# Altium schematic sheet Sheet_NEW.SchDoc
size 840 x 594 mm; Address1: Address1; Address2: Address2; Address3: Address3; Address4: Address4; DocumentNumber: АБВГ.123456.001 Э3; SheetNumber: 1; Scale: 1:1; DocumentType: Схема электрическая принципиальная; FirstReferrence: АБВГ.123456.001
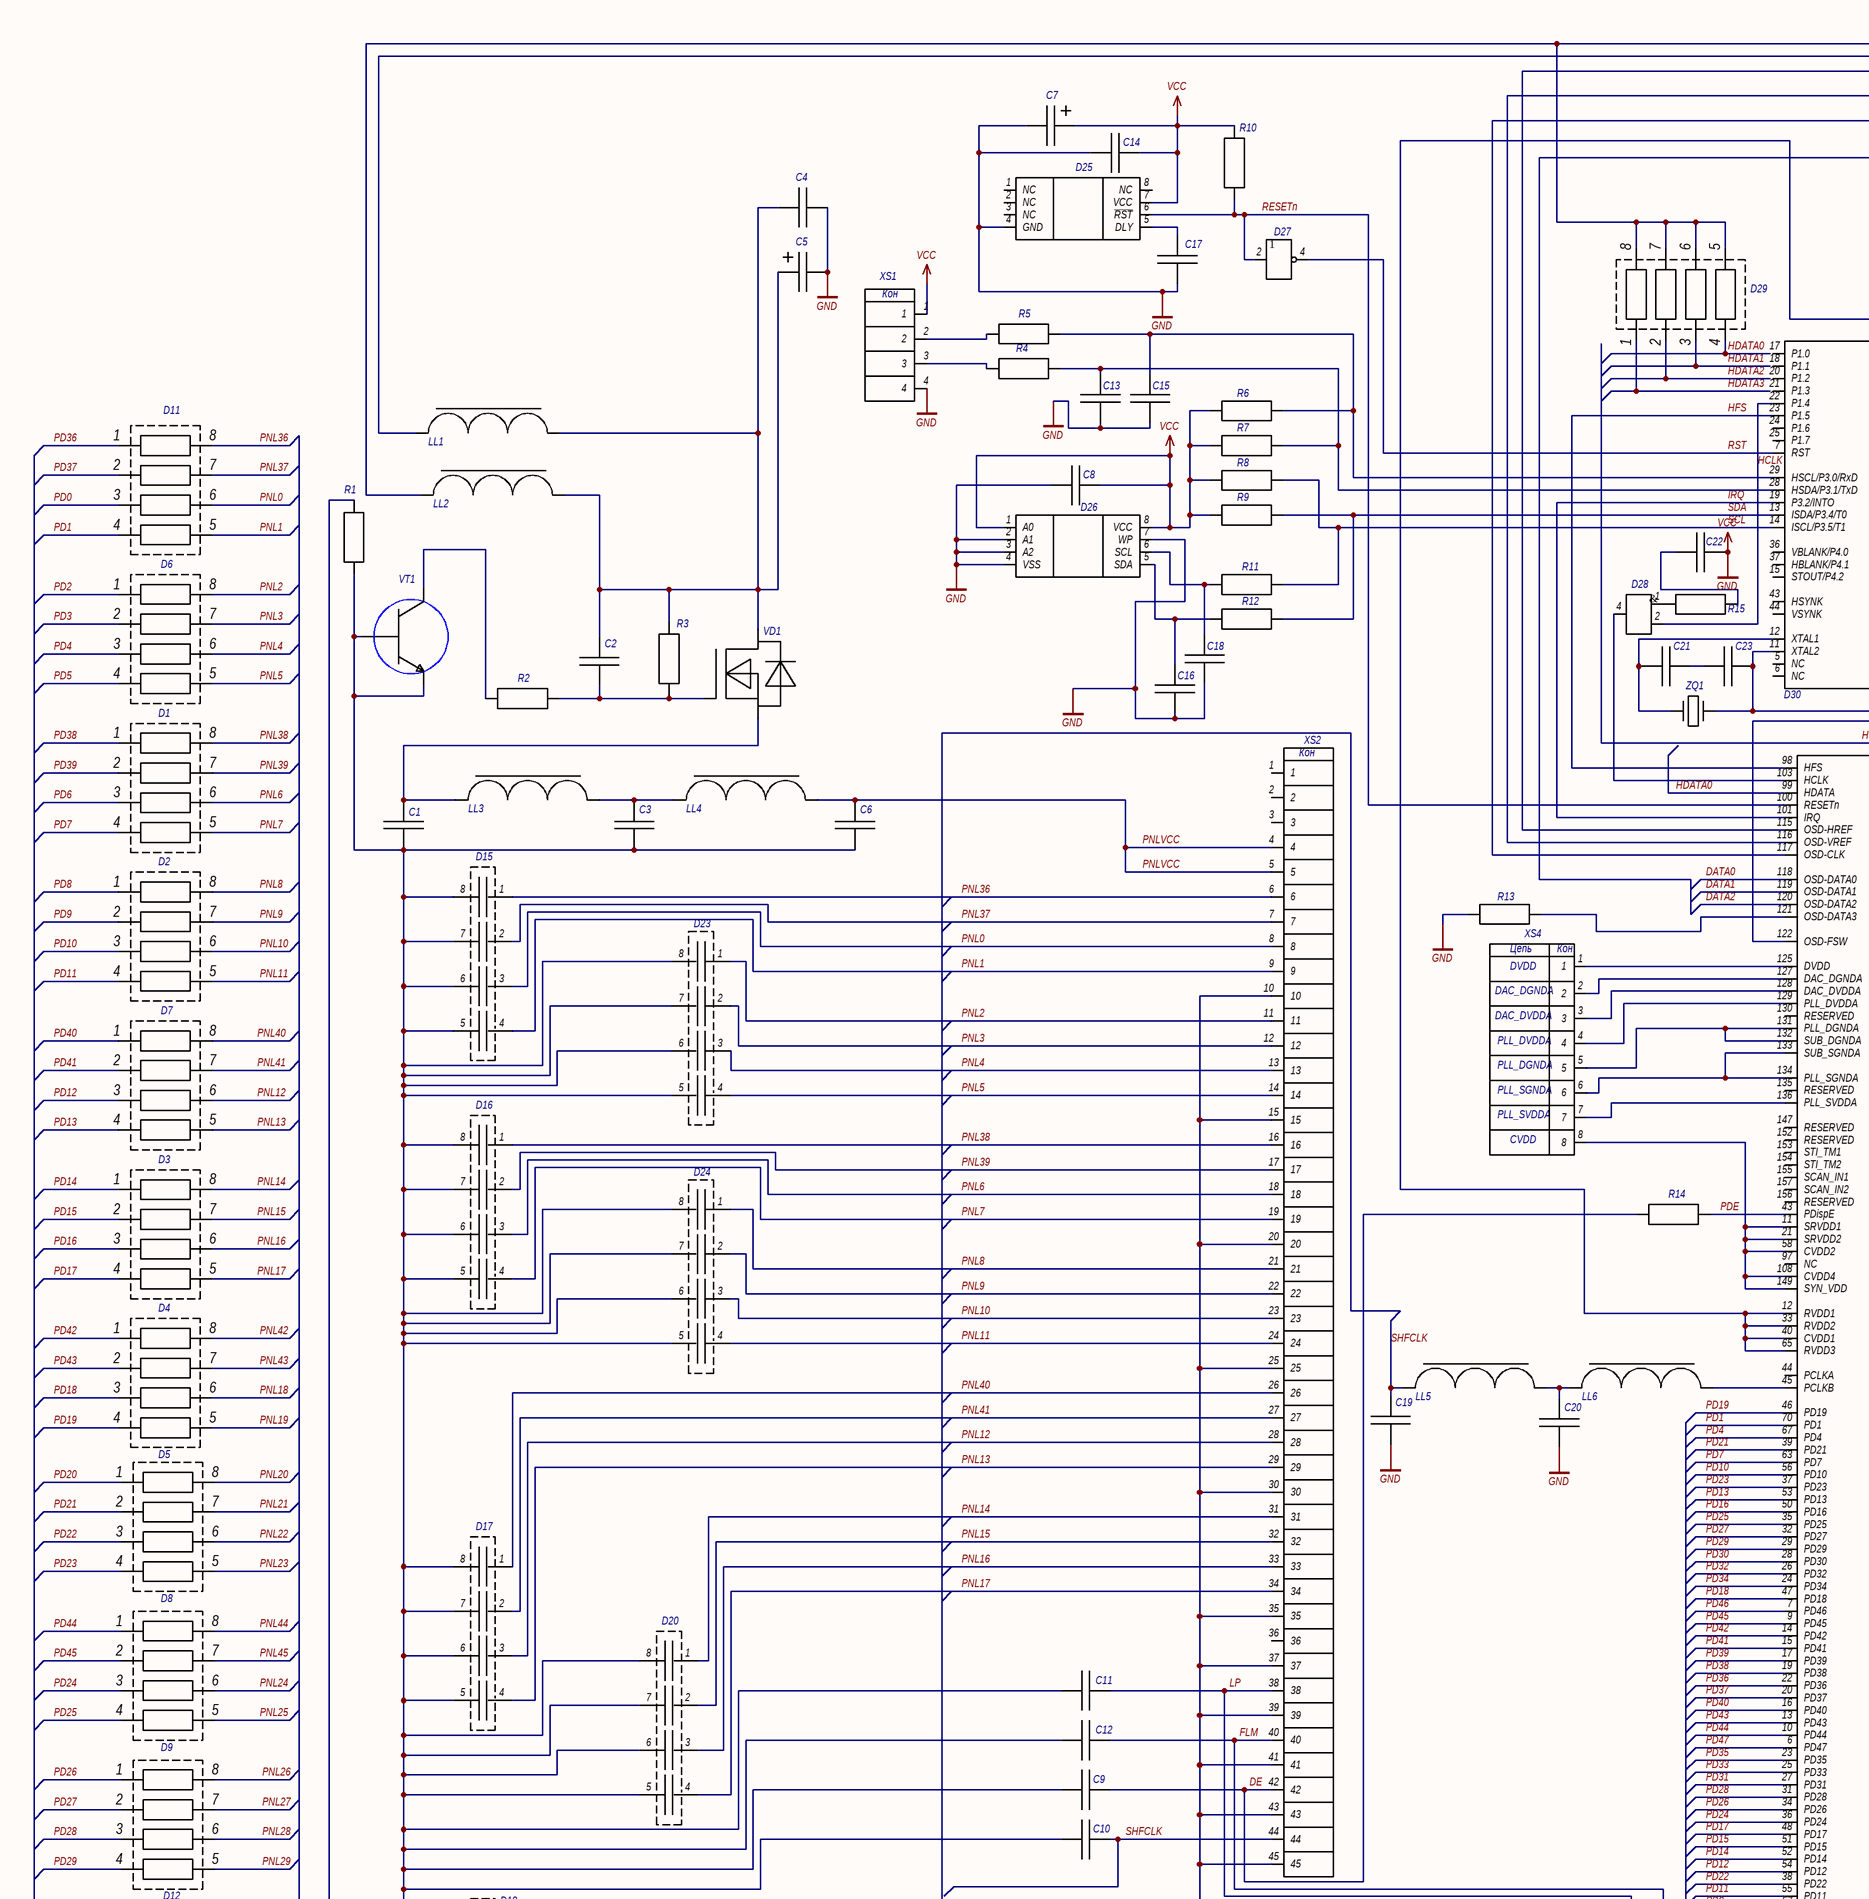
[diagram p0: Sheet_NEW.SchDoc, top left]
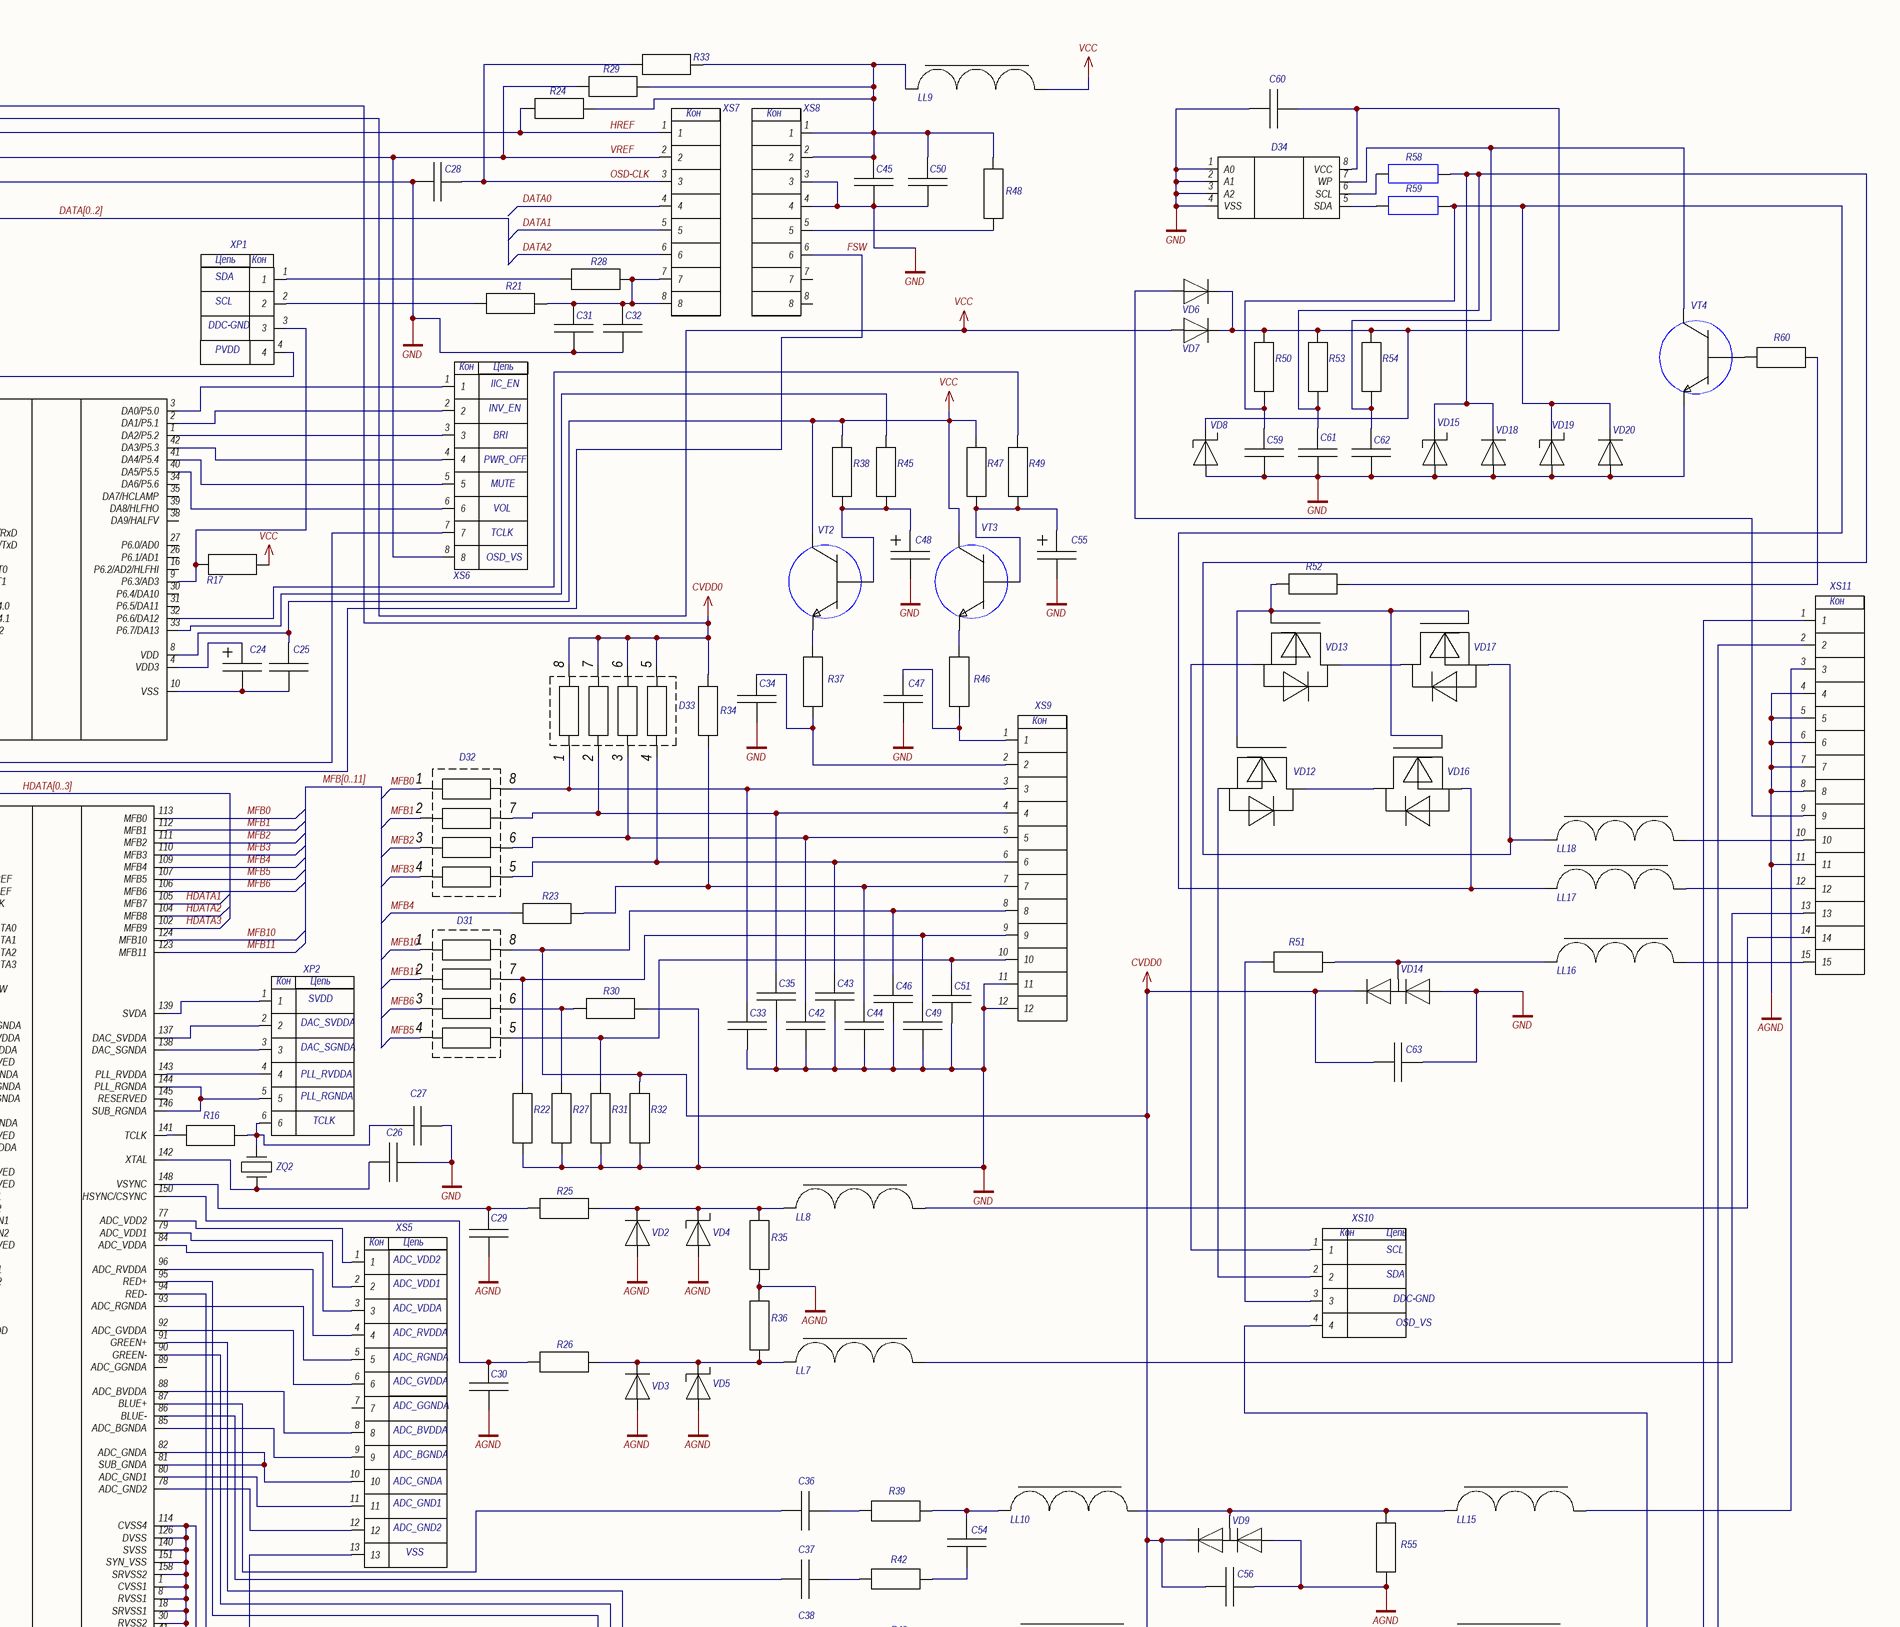
[diagram p1: Sheet_NEW.SchDoc, top right]
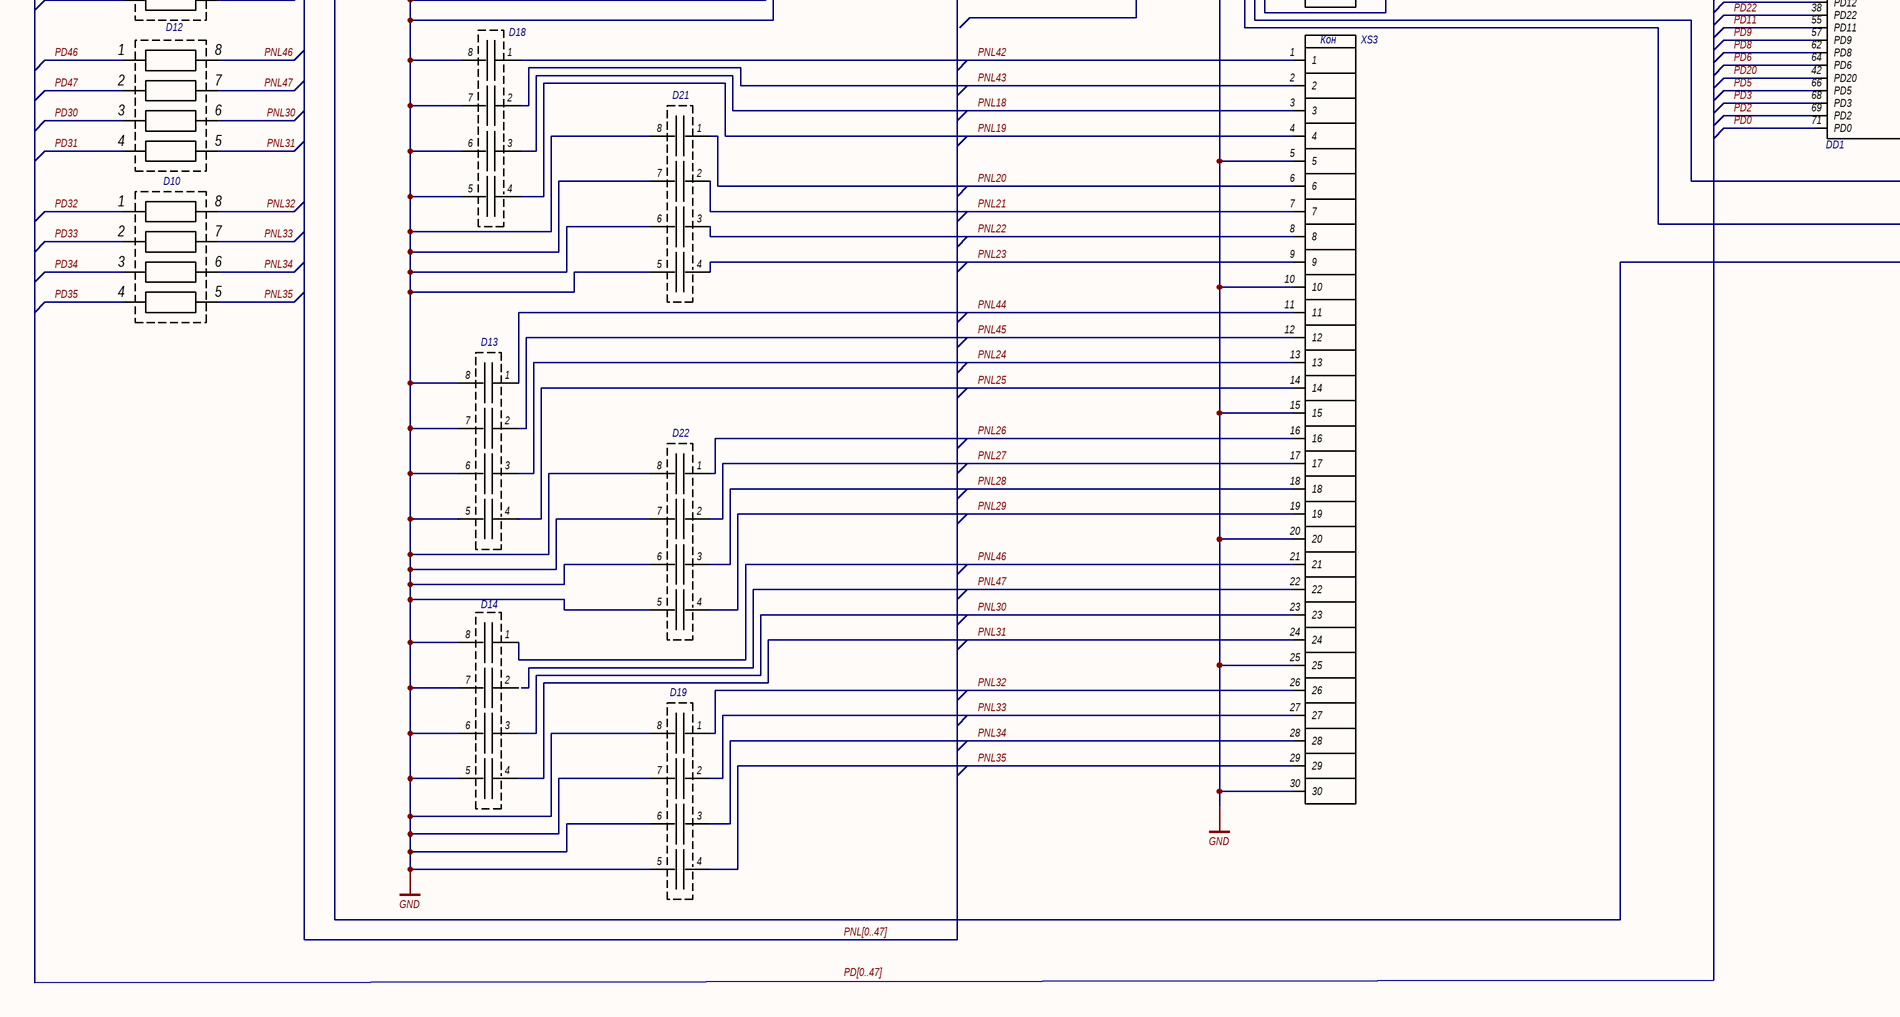
[diagram p2: Sheet_NEW.SchDoc, bottom left]
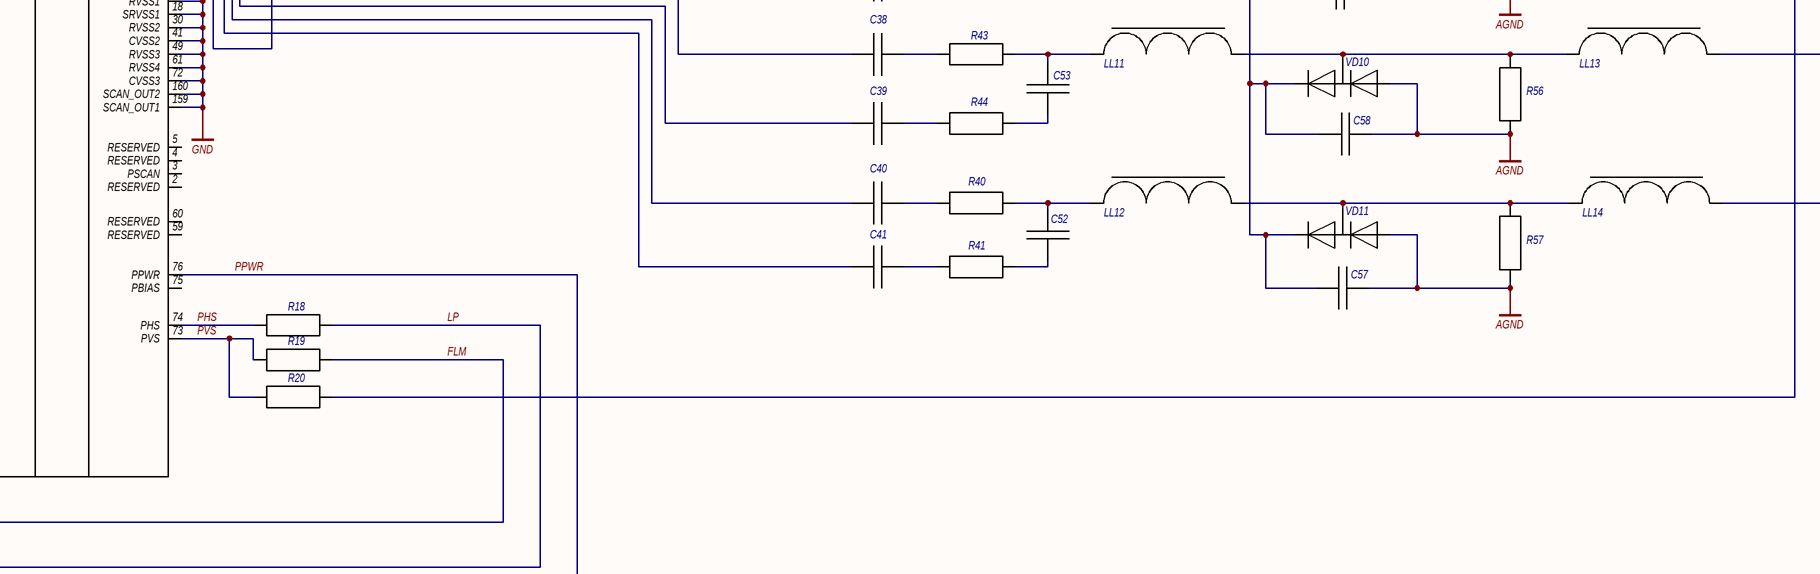
[diagram p3: Sheet_NEW.SchDoc, bottom right]

## Parts
C1  Capacitor  [cap(0603)]  (value not drawn)
C2  Capacitor  [cap(0603)]  (value not drawn)
C3  Capacitor  [cap(0603)]  (value not drawn)
C4  Capacitor  [cap(0603)]  (value not drawn)
C5  Capacitor Duga  [Capacitor 0805]  (value not drawn)
C6  Capacitor  [cap(0603)]  (value not drawn)
C7  Capacitor Duga  [Capacitor 0805]  (value not drawn)
C8  Capacitor  [cap(0603)]  (value not drawn)
C9  Capacitor  [cap(0603)]  (value not drawn)
C10  Capacitor  [cap(0603)]  (value not drawn)
C11  Capacitor  [cap(0603)]  (value not drawn)
C12  Capacitor  [cap(0603)]  (value not drawn)
C13  Capacitor  [cap(0603)]  (value not drawn)
C14  Capacitor  [cap(0603)]  (value not drawn)
C15  Capacitor  [cap(0603)]  (value not drawn)
C16  Capacitor  [cap(0603)]  (value not drawn)
C17  Capacitor  [cap(0603)]  (value not drawn)
C18  Capacitor  [cap(0603)]  (value not drawn)
C19  Capacitor  [cap(0603)]  (value not drawn)
C20  Capacitor  [cap(0603)]  (value not drawn)
C21  Capacitor  [cap(0603)]  (value not drawn)
C22  Capacitor  [cap(0603)]  (value not drawn)
C23  Capacitor  [cap(0603)]  (value not drawn)
C24  Capacitor Duga  [Capacitor 0805]  (value not drawn)
C25  Capacitor  [cap(0603)]  (value not drawn)
C26  Capacitor  [Capacitor 0805]  (value not drawn)
C27  Capacitor  [Capacitor 0805]  (value not drawn)
C28  Capacitor  [cap(0603)]  (value not drawn)
C29  Capacitor  [Capacitor 0805]  (value not drawn)
C30  Capacitor  [Capacitor 0805]  (value not drawn)
C31  Capacitor  [cap(0603)]  (value not drawn)
C32  Capacitor  [cap(0603)]  (value not drawn)
C33  Capacitor  [cap(0603)]  (value not drawn)
C34  Capacitor  [cap(0603)]  (value not drawn)
C35  Capacitor  [cap(0603)]  (value not drawn)
C36  Capacitor  [cap(0603)]  (value not drawn)
C37  Capacitor  [cap(0603)]  (value not drawn)
C38  Capacitor  [cap(0603)]  (value not drawn)
C39  Capacitor  [cap(0603)]  (value not drawn)
C40  Capacitor  [cap(0603)]  (value not drawn)
C41  Capacitor  [cap(0603)]  (value not drawn)
C42  Capacitor  [cap(0603)]  (value not drawn)
C43  Capacitor  [cap(0603)]  (value not drawn)
C44  Capacitor  [cap(0603)]  (value not drawn)
C45  Capacitor  [cap(0603)]  (value not drawn)
C46  Capacitor  [cap(0603)]  (value not drawn)
C47  Capacitor  [cap(0603)]  (value not drawn)
C48  Capacitor Duga  [Capacitor 0805]  (value not drawn)
C49  Capacitor  [cap(0603)]  (value not drawn)
C50  Capacitor  [cap(0603)]  (value not drawn)
C51  Capacitor  [cap(0603)]  (value not drawn)
C52  Capacitor  [cap(0603)]  (value not drawn)
C53  Capacitor  [cap(0603)]  (value not drawn)
C54  Capacitor  [cap(0603)]  (value not drawn)
C55  Capacitor Duga  [Capacitor 0805]  (value not drawn)
C56  Capacitor  [cap(0603)]  (value not drawn)
C57  Capacitor  [cap(0603)]  (value not drawn)
C58  Capacitor  [cap(0603)]  (value not drawn)
C59  Capacitor  [cap(0603)]  (value not drawn)
C60  Capacitor  [cap(0603)]  (value not drawn)
C61  Capacitor  [cap(0603)]  (value not drawn)
C62  Capacitor  [cap(0603)]  (value not drawn)
C63  Capacitor  [cap(0603)]  (value not drawn)
D1  RN  [RN]  (value not drawn)
D2  RN  [RN]  (value not drawn)
D3  RN  [RN]  (value not drawn)
D4  RN  [RN]  (value not drawn)
D5  RN  [RN]  (value not drawn)
D6  RN  [RN]  (value not drawn)
D7  RN  [RN]  (value not drawn)
D8  RN  [RN]  (value not drawn)
D9  RN  [RN]  (value not drawn)
D10  RN  [RN]  (value not drawn)
D11  RN  [RN]  (value not drawn)
D12  RN  [RN]  (value not drawn)
D13  33pFX4  [33pFX4]  (value not drawn)
D14  33pFX4  [33pFX4]  (value not drawn)
D15  33pFX4  [33pFX4]  (value not drawn)
D16  33pFX4  [33pFX4]  (value not drawn)
D17  33pFX4  [33pFX4]  (value not drawn)
D18  33pFX4  [33pFX4]  (value not drawn)
D19  33pFX4  [33pFX4]  (value not drawn)
D20  33pFX4  [33pFX4]  (value not drawn)
D21  33pFX4  [33pFX4]  (value not drawn)
D22  33pFX4  [33pFX4]  (value not drawn)
D23  33pFX4  [33pFX4]  (value not drawn)
D24  33pFX4  [33pFX4]  (value not drawn)
D25  M51953A  [M51953A]  (value not drawn)
D26  24LC32  [24LC32]  (value not drawn)
D27  Inverter  [Inverter]  (value not drawn)
D28  Сonjuncture  [Conjuncture]  (value not drawn)
D29  RN  [RN]  (value not drawn)
D30  MTV312M64  [MTV312M64]  (value not drawn)
D31  RN  [RN]  (value not drawn)
D32  RN  [RN]  (value not drawn)
D33  RN  [RN]  (value not drawn)
D34  24LC32  [24LC32]  (value not drawn)
DD1  gmZAN1_1  [GMZAN1]  (value not drawn)
LL1  dros  [dros]  (value not drawn)
LL2  dros  [dros]  (value not drawn)
LL3  dros  [dros]  (value not drawn)
LL4  dros  [dros]  (value not drawn)
LL5  dros  [dros]  (value not drawn)
LL6  dros  [dros]  (value not drawn)
LL7  dros  [dros]  (value not drawn)
LL8  dros  [dros]  (value not drawn)
LL9  dros  [dros]  (value not drawn)
LL10  dros  [dros]  (value not drawn)
LL11  dros  [dros]  (value not drawn)
LL12  dros  [dros]  (value not drawn)
LL13  dros  [dros]  (value not drawn)
LL14  dros  [dros]  (value not drawn)
LL15  dros  [dros]  (value not drawn)
LL16  dros  [dros]  (value not drawn)
LL17  dros  [dros]  (value not drawn)
LL18  dros  [dros]  (value not drawn)
R1  Resistor  [Resistor 1206]  (value not drawn)
R2  Resistor  [Resistor 1206]  (value not drawn)
R3  Resistor  [Resistor 1206]  (value not drawn)
R4  Resistor  [Resistor 1206]  (value not drawn)
R5  Resistor  [Resistor 1206]  (value not drawn)
R6  Resistor  [Resistor 1206]  (value not drawn)
R7  Resistor  [Resistor 1206]  (value not drawn)
R8  Resistor  [Resistor 1206]  (value not drawn)
R9  Resistor  [Resistor 1206]  (value not drawn)
R10  Resistor  [Resistor 1206]  (value not drawn)
R11  Resistor  [Resistor 1206]  (value not drawn)
R12  Resistor  [Resistor 1206]  (value not drawn)
R13  Resistor  [Resistor 1206]  (value not drawn)
R14  Resistor  [Resistor 1206]  (value not drawn)
R15  Resistor  [Resistor 1206]  (value not drawn)
R16  Resistor  [Resistor 1206]  (value not drawn)
R17  Resistor  [Resistor 1206]  (value not drawn)
R18  Resistor  [Resistor 1206]  (value not drawn)
R19  Resistor  [Resistor 1206]  (value not drawn)
R20  Resistor  [Resistor 1206]  (value not drawn)
R21  Resistor  [Resistor 1206]  (value not drawn)
R22  Resistor  [Resistor 1206]  (value not drawn)
R23  Resistor  [Resistor 1206]  (value not drawn)
R24  Resistor  [Resistor 1206]  (value not drawn)
R25  Resistor  [Resistor 1206]  (value not drawn)
R26  Resistor  [Resistor 1206]  (value not drawn)
R27  Resistor  [Resistor 1206]  (value not drawn)
R28  Resistor  [Resistor 1206]  (value not drawn)
R29  Resistor  [Resistor 1206]  (value not drawn)
R30  Resistor  [Resistor 1206]  (value not drawn)
R31  Resistor  [Resistor 1206]  (value not drawn)
R32  Resistor  [Resistor 1206]  (value not drawn)
R33  Resistor  [Resistor 1206]  (value not drawn)
R34  Resistor  [Resistor 1206]  (value not drawn)
R35  Resistor  [Resistor 1206]  (value not drawn)
R36  Resistor  [Resistor 1206]  (value not drawn)
R37  Resistor  [Resistor 1206]  (value not drawn)
R38  Resistor  [Resistor 1206]  (value not drawn)
R39  Resistor  [Resistor 1206]  (value not drawn)
R40  Resistor  [Resistor 1206]  (value not drawn)
R41  Resistor  [Resistor 1206]  (value not drawn)
R42  Resistor  [Resistor 1206]  (value not drawn)
R43  Resistor  [Resistor 1206]  (value not drawn)
R44  Resistor  [Resistor 1206]  (value not drawn)
R45  Resistor  [Resistor 1206]  (value not drawn)
R46  Resistor  [Resistor 1206]  (value not drawn)
R47  Resistor  [Resistor 1206]  (value not drawn)
R48  Resistor  [Resistor 1206]  (value not drawn)
R49  Resistor  [Resistor 1206]  (value not drawn)
R50  Resistor  [Resistor 1206]  (value not drawn)
R51  Resistor  [Resistor 1206]  (value not drawn)
R52  Resistor  [Resistor 1206]  (value not drawn)
R53  Resistor  [Resistor 1206]  (value not drawn)
R54  Resistor  [Resistor 1206]  (value not drawn)
R55  Resistor  [Resistor 1206]  (value not drawn)
R56  Resistor  [Resistor 1206]  (value not drawn)
R57  Resistor  [Resistor 1206]  (value not drawn)
R58  Res  [res(0603)]  (value not drawn)
R59  Res  [res(0603)]  (value not drawn)
R60  Resistor  [Resistor 1206]  (value not drawn)
VD1  2SK3018  [DAT17]  (value not drawn)
VD2  Diode  [DIODE]  (value not drawn)
VD3  Diode  [DIODE]  (value not drawn)
VD4  Diode(shotki)  [Diode(shotki)]  (value not drawn)
VD5  Diode(shotki)  [Diode(shotki)]  (value not drawn)
VD6  Diode  [DIODE]  (value not drawn)
VD7  Diode  [DIODE]  (value not drawn)
VD8  Diode(shotki)  [Diode(shotki)]  (value not drawn)
VD9  DAN17  [DAT17]  (value not drawn)
VD10  DAN17  [DAT17]  (value not drawn)
VD11  DAN17  [DAT17]  (value not drawn)
VD12  2SK3018  [DAT17]  (value not drawn)
VD13  2SK3018  [DAT17]  (value not drawn)
VD14  DAN17  [DAT17]  (value not drawn)
VD15  Diode(shotki)  [Diode(shotki)]  (value not drawn)
VD16  2SK3018  [DAT17]  (value not drawn)
VD17  2SK3018  [DAT17]  (value not drawn)
VD18  Diode  [DIODE]  (value not drawn)
VD19  Diode(shotki)  [Diode(shotki)]  (value not drawn)
VD20  Diode  [DIODE]  (value not drawn)
VT1  Transistor 2_1  [Transistor 1]  (value not drawn)
VT2  Transistor 2_1  [Transistor 1]  (value not drawn)
VT3  Transistor 2_1  [Transistor 1]  (value not drawn)
VT4  Transistor 2_1  [Transistor 1]  (value not drawn)
XP1  All pins_1  [Header 4]  (value not drawn)
XP2  XP-2-I306B  [All pins]  (value not drawn)
XS1  Header 4  [Header 4]  (value not drawn)
XS2  Header 45  [Header 45]  (value not drawn)
XS3  Header 30  [Header 30]  (value not drawn)
XS4  XS-2-I306B  [Header 8]  (value not drawn)
XS5  XS-2-I306C  [header 13]  (value not drawn)
XS6  All pins_2  [All pins]  (value not drawn)
XS7  Header 8  [All pins]  (value not drawn)
XS8  Header 8_1  [All pins]  (value not drawn)
XS9  Header 12  [All pins]  (value not drawn)
XS10  Header 4  [Header 4]  (value not drawn)
XS11  Header 15  [All pins]  (value not drawn)
ZQ1  Quartz  [HC-49/U]  (value not drawn)
ZQ2  Quartz  [HC-49/U]  (value not drawn)

## Nets
AGND: C29.1 C30.1 C56.1 C57.1 C58.1 R35.2 R36.1 R55.1 R56.1 R57.1 VD2.1 VD3.1 VD4.1 VD5.1 VD9.2 VD10.2 VD11.2 XS11.4 XS11.5 XS11.6 XS11.7 XS11.8 XS11.11
CVDD0: C46.2 C56.2 C57.2 C58.2 C63.2 D29.5 D29.6 D29.7 D29.8 D31.8 D33.5 D33.6 D33.7 D33.8 LL2.1 R32.2 R34.2 VD9.1 VD10.1 VD11.1 VD14.1 XS9.8
GND: C1.1 C3.1 C4.1 C5.1 C6.1 C7.1 C7.2 C8.1 C8.2 C9.2 C10.2 C11.2 C12.2 C13.1 C14.1 C14.2 C15.1 C16.1 C17.1 C18.1 C19.1 C20.1 C22.1 C25.2 C26.1 C27.1 C28.1 C31.1 C32.1 C33.1 C34.1 C35.1 C42.1 C43.1 C44.1 C45.1 C46.1 C47.1 C48.1 C49.1 C50.1 C51.1 C55.1 C59.1 C60.2 C61.1 C62.1 C63.1 D13.5 D13.6 D13.7 D13.8 D14.5 D14.6 D14.7 D14.8 D15.5 D15.6 D15.7 D15.8 D16.5 D16.6 D16.7 D16.8 D17.5 D17.6 D17.7 D17.8 D18.5 D18.6 D18.7 D18.8 D19.5 D19.6 D19.7 D19.8 D20.5 D20.6 D20.7 D20.8 D21.5 D21.6 D21.7 D21.8 D22.5 D22.6 D22.7 D22.8 D23.5 D23.6 D23.7 D23.8 D24.5 D24.6 D24.7 D24.8 D25.4(GND) D25.7(VCC) D26.1(A0) D26.2(A1) D26.3(A2) D26.4(VSS) D26.7(WP) D26.8(VCC) D27.3(GND) D27.5(VCC) D28.3(GND) D28.5(VCC) D30.8(VDD) D34.1(A0) D34.2(A1) D34.3(A2) D34.4(VSS) DD1.1(CVSS1) DD1.8(RVSS1) DD1.18(SRVSS1) DD1.30(RVSS2) DD1.41(CVSS2) DD1.49(RVSS3) DD1.61(RVSS4) DD1.72(CVSS3) DD1.114(CVSS4) DD1.117(OSD-CLK) DD1.126(DVSS) DD1.140(SVSS) DD1.151(SYN_VSS) DD1.158(SRVSS2) DD1.159(SCAN_OUT1) DD1.160(SCAN_OUT2) LL1.1 LL9.2 R1.1 R6.1 R7.1 R8.1 R9.1 R10.2 R13.1 R17.1 R22.1 R27.1 R30.2 R31.1 R32.1 R38.1 R47.1 VD7.1 VD8.1 VD14.2 VD15.1 VD18.1 VD19.1 VD20.1 VT1.2(EMITTER) VT1.3(BAZA) VT2.1(KOLLECTOR) VT3.1(KOLLECTOR) VT4.2(EMITTER) XS1.1 XS1.4 XS2.10 XS2.15 XS2.20 XS2.25 XS2.30 XS2.35 XS2.37 XS2.39 XS2.41 XS2.43 XS2.45 XS3.5 XS3.10 XS3.15 XS3.20 XS3.25 XS3.30 XS5.13 XS8.3 XS8.4 XS9.11 XS9.12  [also labelled VCC]
DATA0: DD1.118(OSD-DATA0) XS7.4
DATA1: DD1.119(OSD-DATA1) XS7.5
DATA2: DD1.120(OSD-DATA2) XS7.6
DE: C9.1 R14.1 XS2.42
FLM: C12.1 R19.2 XS2.40
FSW: DD1.122(OSD-FSW) XS8.6
HCLK: D28.2 D30.22(P1.4)
HDATA0: D29.4 DD1.99(HDATA)
HDATA1: D29.3 DD1.105(MFB7)
HDATA2: D29.2 DD1.104(MFB8)
HDATA3: D29.1 DD1.102(MFB9)
HFS: D30.23(P1.5) DD1.98(HFS)
HREF: DD1.115(OSD-HREF) R24.1 XS7.1
IRQ: D30.19(P3.2/INTO) DD1.101(IRQ)
LP: C11.1 R18.2 XS2.38
MFB0: D32.1 DD1.113(MFB0)
MFB1: D32.2 DD1.112(MFB1)
MFB2: D32.3 DD1.111(MFB2)
MFB3: D32.4 DD1.110(MFB3)
MFB4: DD1.109(MFB4) R23.1
MFB5: D31.4 DD1.107(MFB5)
MFB6: D31.3 DD1.106(MFB6)
MFB10: D31.1 DD1.124(MFB10)
MFB11: D31.2 DD1.123(MFB11)
OSD-CLK: C28.2 R33.1 XS7.3
PD0: D11.3 DD1.71(PD0)
PD1: D11.4 DD1.70(PD1)
PD2: D6.1 DD1.69(PD2)
PD3: D6.2 DD1.68(PD3)
PD4: D6.3 DD1.67(PD4)
PD5: D6.4 DD1.66(PD5)
PD6: D1.3 DD1.64(PD6)
PD7: D1.4 DD1.63(PD7)
PD8: D2.1 DD1.62(PD8)
PD9: D2.2 DD1.57(PD9)
PD10: D2.3 DD1.56(PD10)
PD11: D2.4 DD1.55(PD11)
PD12: D7.3 DD1.54(PD12)
PD13: D7.4 DD1.53(PD13)
PD14: D3.1 DD1.52(PD14)
PD15: D3.2 DD1.51(PD15)
PD16: D3.3 DD1.50(PD16)
PD17: D3.4 DD1.48(PD17)
PD18: D4.3 DD1.47(PD18)
PD19: D4.4 DD1.46(PD19)
PD20: D5.1 DD1.42(PD20)
PD21: D5.2 DD1.39(PD21)
PD22: D5.3 DD1.38(PD22)
PD23: D5.4 DD1.37(PD23)
PD24: D8.3 DD1.36(PD24)
PD25: D8.4 DD1.35(PD25)
PD26: D9.1 DD1.34(PD26)
PD27: D9.2 DD1.32(PD27)
PD28: D9.3 DD1.31(PD28)
PD29: D9.4 DD1.29(PD29)
PD30: D12.3 DD1.28(PD30)
PD31: D12.4 DD1.27(PD31)
PD32: D10.1 DD1.26(PD32)
PD33: D10.2 DD1.25(PD33)
PD34: D10.3 DD1.24(PD34)
PD35: D10.4 DD1.23(PD35)
PD36: D11.1 DD1.22(PD36)
PD37: D11.2 DD1.20(PD37)
PD38: D1.1 DD1.19(PD38)
PD39: D1.2 DD1.17(PD39)
PD40: D7.1 DD1.16(PD40)
PD41: D7.2 DD1.15(PD41)
PD42: D4.1 DD1.14(PD42)
PD43: D4.2 DD1.13(PD43)
PD44: D8.1 DD1.10(PD44)
PD45: D8.2 DD1.9(PD45)
PD46: D12.1 DD1.7(PD46)
PD47: D12.2 DD1.6(PD47)
PDE: DD1.43(PDispE) R14.2
PHS: DD1.74(PHS) R18.1
PNL0: D11.6 D15.3 XS2.8
PNL1: D11.5 D15.4 XS2.9
PNL2: D6.8 D23.1 XS2.11
PNL3: D6.7 D23.2 XS2.12
PNL4: D6.6 D23.3 XS2.13
PNL5: D6.5 D23.4 XS2.14
PNL6: D1.6 D16.3 XS2.18
PNL7: D1.5 D16.4 XS2.19
PNL8: D2.8 D24.1 XS2.21
PNL9: D2.7 D24.2 XS2.22
PNL10: D2.6 D24.3 XS2.23
PNL11: D2.5 D24.4 XS2.24
PNL12: D7.6 D17.3 XS2.28
PNL13: D7.5 D17.4 XS2.29
PNL14: D3.8 D20.1 XS2.31
PNL15: D3.7 D20.2 XS2.32
PNL16: D3.6 D20.3 XS2.33
PNL17: D3.5 D20.4 XS2.34
PNL18: D4.6 D18.3 XS3.3
PNL19: D4.5 D18.4 XS3.4
PNL20: D5.8 D21.1 XS3.6
PNL21: D5.7 D21.2 XS3.7
PNL22: D5.6 D21.3 XS3.8
PNL23: D5.5 D21.4 XS3.9
PNL24: D8.6 D13.3 XS3.13
PNL25: D8.5 D13.4 XS3.14
PNL26: D9.8 D22.1 XS3.16
PNL27: D9.7 D22.2 XS3.17
PNL28: D9.6 D22.3 XS3.18
PNL29: D9.5 D22.4 XS3.19
PNL30: D12.6 D14.3 XS3.23
PNL31: D12.5 D14.4 XS3.24
PNL32: D10.8 D19.1 XS3.26
PNL33: D10.7 D19.2 XS3.27
PNL34: D10.6 D19.3 XS3.28
PNL35: D10.5 D19.4 XS3.29
PNL36: D11.8 D15.1 XS2.6
PNL37: D11.7 D15.2 XS2.7
PNL38: D1.8 D16.1 XS2.16
PNL39: D1.7 D16.2 XS2.17
PNL40: D7.8 D17.1 XS2.26
PNL41: D7.7 D17.2 XS2.27
PNL42: D4.8 D18.1 XS3.1
PNL43: D4.7 D18.2 XS3.2
PNL44: D8.8 D13.1 XS3.11
PNL45: D8.7 D13.2 XS3.12
PNL46: D12.8 D14.1 XS3.21
PNL47: D12.7 XS3.22
PNLVCC: C6.2 LL4.2 XS2.4 XS2.5
PPWR: DD1.76(PPWR) R1.2
PVS: DD1.73(PVS) R19.1 R20.1
RESETn: D25.6(~{RST}) D27.2 DD1.100(RESETn) R10.1
RST: D27.4 D30.7(RST)
SCL: D30.14(ISCL/P3.5/T1) R8.2 R11.2
SDA: D30.13(ISDA/P3.4/T0) R9.2 R12.2
SHFCLK: C10.1 C19.2 LL5.1 XS2.44
VREF: DD1.116(OSD-VREF) R29.1 XS6.8 XS7.2
NetC1_2: C1.2 LL3.1 VD1.1
NetC2_1: C2.1 R2.2 R3.1 VD1.2
NetC2_2: C2.2 C4.2 C5.2 LL1.2 LL2.2 R3.2 VD1.3
NetC3_2: C3.2 LL3.2 LL4.1
NetC13_2: C13.2 D30.28(HSDA/P3.1/TxD) R4.2 R7.2
NetC15_2: C15.2 D30.29(HSCL/P3.0/RxD) R5.2 R6.2
NetC16_2: C16.2 D26.5(SDA) R12.1
NetC17_2: C17.2 D25.5(DLY)
NetC18_2: C18.2 D26.6(SCL) R11.1
NetC20_2: C20.2 LL5.2 LL6.1
NetC21_1: C21.1 C23.2
NetC21_2: C21.2 D30.12(XTAL1) ZQ1.1
NetC22_2: C22.2 R15.1
NetC23_1: C23.1 D30.11(XTAL2) XS6.7 ZQ1.2
NetC24_1: C24.1 C25.1 D30.10(VSS)
NetC24_2: C24.2 D30.4(VDD3)
NetC26_2: C26.2 DD1.142(XTAL) ZQ2.1
NetC27_2: C27.2 R16.2 XP2.6 ZQ2.2
NetC29_2: C29.2 DD1.148(VSYNC) R25.1
NetC30_2: C30.2 DD1.150(HSYNC/CSYNC) R26.1
NetC31_2: C31.2 C32.2 R21.2 R28.2 XS7.7 XS7.8
NetC33_2: C33.2 D32.8 D33.1 XS9.3
NetC34_2: C34.2 R37.2 XS9.2
NetC35_2: C35.2 D32.7 D33.2 XS9.4
NetC36_1: C36.1 R39.1
NetC36_2: C36.2 DD1.87(BLUE+)
NetC37_1: C37.1 R42.1
NetC37_2: C37.2 DD1.86(BLUE-)
NetC38_1: C38.1 R43.1
NetC38_2: C38.2 DD1.91(GREEN+)
NetC39_1: C39.1 R44.1
NetC39_2: C39.2 DD1.90(GREEN-)
NetC40_1: C40.1 R40.1
NetC40_2: C40.2 DD1.95(RED+)
NetC41_1: C41.1 R41.1
NetC41_2: C41.2 DD1.94(RED-)
NetC42_2: C42.2 D32.6 D33.3 XS9.5
NetC43_2: C43.2 D32.5 D33.4 XS9.6
NetC44_2: C44.2 R23.2 R34.1 XS9.7
NetC45_2: C45.2 C50.2 LL9.1 R24.2 R29.2 R33.2 R48.2 XS8.1 XS8.2
NetC47_2: C47.2 R46.2 XS9.1
NetC48_2: C48.2 R38.2 R45.2 VT2.3(BAZA)
NetC49_2: C49.2 D31.7 R22.2 XS9.9
NetC51_2: C51.2 D31.5 R31.2 XS9.10
NetC52_1: C52.1 R41.2
NetC52_2: C52.2 LL12.1 R40.2
NetC53_1: C53.1 R44.2
NetC53_2: C53.2 LL11.1 R43.2
NetC54_1: C54.1 R42.2
NetC54_2: C54.2 LL10.1 R39.2
NetC55_2: C55.2 R47.2 R49.2 VT3.3(BAZA)
NetC59_2: C59.2 LL17.1 R50.2 R59.2 VD16.1 VD19.2 VD20.2
NetC60_1: C60.1 D34.8(VCC) R50.1 R53.1 R54.1 VD6.2 VD7.2 VD8.2
NetC61_2: C61.2 LL18.1 R53.2 R58.2 VD15.2 VD17.1 VD18.2
NetC62_2: C62.2 D34.7(WP) R54.2 VT4.1(KOLLECTOR)
NetD28_1: D28.1 R15.2
NetD28_4: D28.4 DD1.103(HCLK)
NetD30_1: D30.1(DA2/P5.2) XS6.3
NetD30_2: D30.2(DA1/P5.1) XS6.2
NetD30_3: D30.3(DA0/P5.0) XS6.1
NetD30_9: D30.9(P6.3/AD3) R17.2 XP1.3
NetD30_32: D30.32(P6.6/DA12) R49.1
NetD30_33: D30.33(P6.7/DA13) R45.1
NetD30_40: D30.40(DA5/P5.5) XS6.6
NetD30_41: D30.41(DA4/P5.4) XS6.5
NetD30_42: D30.42(DA3/P5.3) XS6.4
NetD31_6: D31.6 R27.2 R30.1
NetD34_5: D34.5(SDA) R59.1
NetD34_6: D34.6(SCL) R58.1
NetDD1_11: DD1.11(SRVDD1) DD1.21(SRVDD2) DD1.58(CVDD2) DD1.108(CVDD4) DD1.149(SYN_VDD) XS4.8
NetDD1_12: DD1.12(RVDD1) DD1.33(RVDD2) DD1.40(CVDD1) DD1.65(RVDD3) XP1.4
NetDD1_45: DD1.45(PCLKB) LL6.2
NetDD1_77: DD1.77(ADC_VDD2) XS5.1
NetDD1_78: DD1.78(ADC_GND2) XS5.12
NetDD1_79: DD1.79(ADC_VDD1) XS5.2
NetDD1_80: DD1.80(ADC_GND1) XS5.11
NetDD1_81: DD1.81(SUB_GNDA) DD1.82(ADC_GNDA) XS5.10
NetDD1_84: DD1.84(ADC_VDDA) XS5.3
NetDD1_85: DD1.85(ADC_BGNDA) XS5.9
NetDD1_88: DD1.88(ADC_BVDDA) XS5.8
NetDD1_92: DD1.92(ADC_GVDDA) XS5.6
NetDD1_93: DD1.93(ADC_RGNDA) XS5.5
NetDD1_96: DD1.96(ADC_RVDDA) XS5.4
NetDD1_121: DD1.121(OSD-DATA3) R13.2
NetDD1_125: DD1.125(DVDD) XS4.1
NetDD1_127: DD1.127(DAC_DGNDA) XS4.2
NetDD1_128: DD1.128(DAC_DVDDA) XS4.3
NetDD1_129: DD1.129(PLL_DVDDA) XS4.4
NetDD1_131: DD1.131(PLL_DGNDA) DD1.132(SUB_DGNDA) XS4.5
NetDD1_133: DD1.133(SUB_SGNDA) DD1.134(PLL_SGNDA) XS4.6
NetDD1_136: DD1.136(PLL_SVDDA) XS4.7
NetDD1_137: DD1.137(DAC_SVDDA) XP2.2
NetDD1_138: DD1.138(DAC_SGNDA) XP2.3
NetDD1_139: DD1.139(SVDA) XP2.1
NetDD1_141: DD1.141(TCLK) R16.1
NetDD1_143: DD1.143(PLL_RVDDA) XP2.4
NetDD1_144: DD1.144(PLL_RGNDA) DD1.146(SUB_RGNDA) XP2.5
NetLL7_1: LL7.1 R26.2 R36.2 VD3.2 VD5.2
NetLL7_2: LL7.2 XS11.13
NetLL8_1: LL8.1 R25.2 R35.1 VD2.2 VD4.2
NetLL8_2: LL8.2 XS11.14
NetLL10_2: LL10.2 LL15.1 R55.2 VD9.3
NetLL11_2: LL11.2 LL13.1 R56.2 VD10.3
NetLL12_2: LL12.2 LL14.1 R57.2 VD11.3
NetLL13_2: LL13.2 XS11.2
NetLL14_2: LL14.2 XS11.1
NetLL15_2: LL15.2 XS11.3
NetLL16_1: LL16.1 R51.2 VD14.3
NetLL16_2: LL16.2 XS11.15
NetLL17_2: LL17.2 XS11.12
NetLL18_2: LL18.2 XS11.10
NetR2_1: R2.1 VT1.1(KOLLECTOR)
NetR4_1: R4.1 XS1.3
NetR5_1: R5.1 XS1.2
NetR20_2: R20.2 XS10.4
NetR21_1: R21.1 XP1.2
NetR28_1: R28.1 XP1.1
NetR37_1: R37.1 VT2.2(EMITTER)
NetR46_1: R46.1 VT3.2(EMITTER)
NetR48_1: R48.1 XS8.5
NetR51_1: R51.1 XS10.3
NetR52_1: R52.1 VD12.2 VD13.2 VD16.2 VD17.2
NetR52_2: R52.2 R60.2
NetR60_1: R60.1 VT4.3(BAZA)
NetVD6_1: VD6.1 XS11.9
NetVD12_1: VD12.1 XS10.2
NetVD12_3: VD12.3 VD16.3
NetVD13_1: VD13.1 XS10.1
NetVD13_3: VD13.3 VD17.3

Not connected (* = marked no-connect by the designer): D14 2; D25 1(NC) 2(NC) 3(NC) 8(NC); D27 1(NC); D28 6(NC); D30 5(NC) 6(NC) 15(STOUT/P4.2) 16(P6.2/AD2/HLFHI) 17(P1.0) 18(P1.1) 20(P1.2) 21(P1.3) 24(P1.6) 25(P1.7) 26(P6.1/AD1) 27(P6.0/AD0) 30(P6.4/DA10) 31(P6.5/DA11) 34(DA6/P5.6) 35(DA7/HCLAMP) 36(VBLANK/P4.0) 37(HBLANK/P4.1) 38(DA9/HALFV) 39(DA8/HLFHO) 43(HSYNK) 44(VSYNK); DD1 2(RESERVED) 3(PSCAN) 4(RESERVED) 5(RESERVED) 44(PCLKA) 59(RESERVED) 60(RESERVED) 75(PBIAS) 89(ADC_GGNDA) 97(NC) 130(RESERVED) 135(RESERVED) 145(RESERVED) 147(RESERVED) 152(RESERVED) 153(STI_TM1) 154(STI_TM2) 155(SCAN_IN1) 156(RESERVED) 157(SCAN_IN2); XS2 1 2 3 36; XS5 7; XS8 7 8

## Buses and harness runs
bus DATA[0..2]
bus HDATA[0..3]
bus MFB[0..11]
bus PD[0..47]
bus PNL[0..47]

## Notes on the sheet
- Labels drawn without touching a wire or pin: PD[0..47]
- Перв. примен.
- Справ. №
- Подп. и дата
- Инв. № дубл.
- Взам. инв. №
- Разраб.
- Изм.
- Лист
- № докум.
- Подп.
- Дата
- Лит.
- Масса
- Масштаб
- Пров.
- Т.контр.
- Листов
- Инв. № подл.
- Утв.
- Н.контр.
- 2.106-A1
- Копировал
- Формат А1
- (in symbol All pins_1) Цепь; Кон; SDA; SCL; DDC-GND; PVDD
- (in symbol All pins_2) Кон; Цепь; IIC_EN; INV_EN; BRI; PWR_OFF; MUTE; VOL; TCLK; OSD_VS
- (in symbol Header 4) Кон; Цепь; SCL; SDA; DDC-GND; OSD_VS
- (in symbol Header 8) Кон
- (in symbol Header 8_1) Кон
- (in symbol Header 12) Кон
- (in symbol Header 15) Кон
- (in symbol Header 30) Кон
- (in symbol Header 45) Кон
- (in symbol XP-2-I306B) Кон; Цепь; SVDD; DAC_SVDDA; DAC_SGNDA; PLL_RVDDA; PLL_RGNDA; TCLK
- (in symbol XS-2-I306B) Цепь; Кон; DVDD; DAC_DGNDA; DAC_DVDDA; PLL_DVDDA; PLL_DGNDA; PLL_SGNDA; PLL_SVDDA; CVDD
- (in symbol XS-2-I306C) Кон; Цепь; ADC_VDD2; ADC_VDD1; ADC_VDDA; ADC_RVDDA; ADC_RGNDA; ADC_GVDDA; ADC_GGNDA; ADC_BVDDA; ADC_BGNDA; ADC_GNDA; ADC_GND1; ADC_GND2; VSS
- (in symbol Сonjuncture) &

## Library data of the parts
C1-C4 C6 C8-C23 C25-C47 C49-C54 C56-C63 = Capacitor: Model: *
C5 C7 C24 C48 C55 = Capacitor Duga: Model: *
D13-D24 = 33pFX4: Model: *
R1-R57 R60 = Resistor: Model: *